# Altium schematic sheet module.SchDoc
size A4
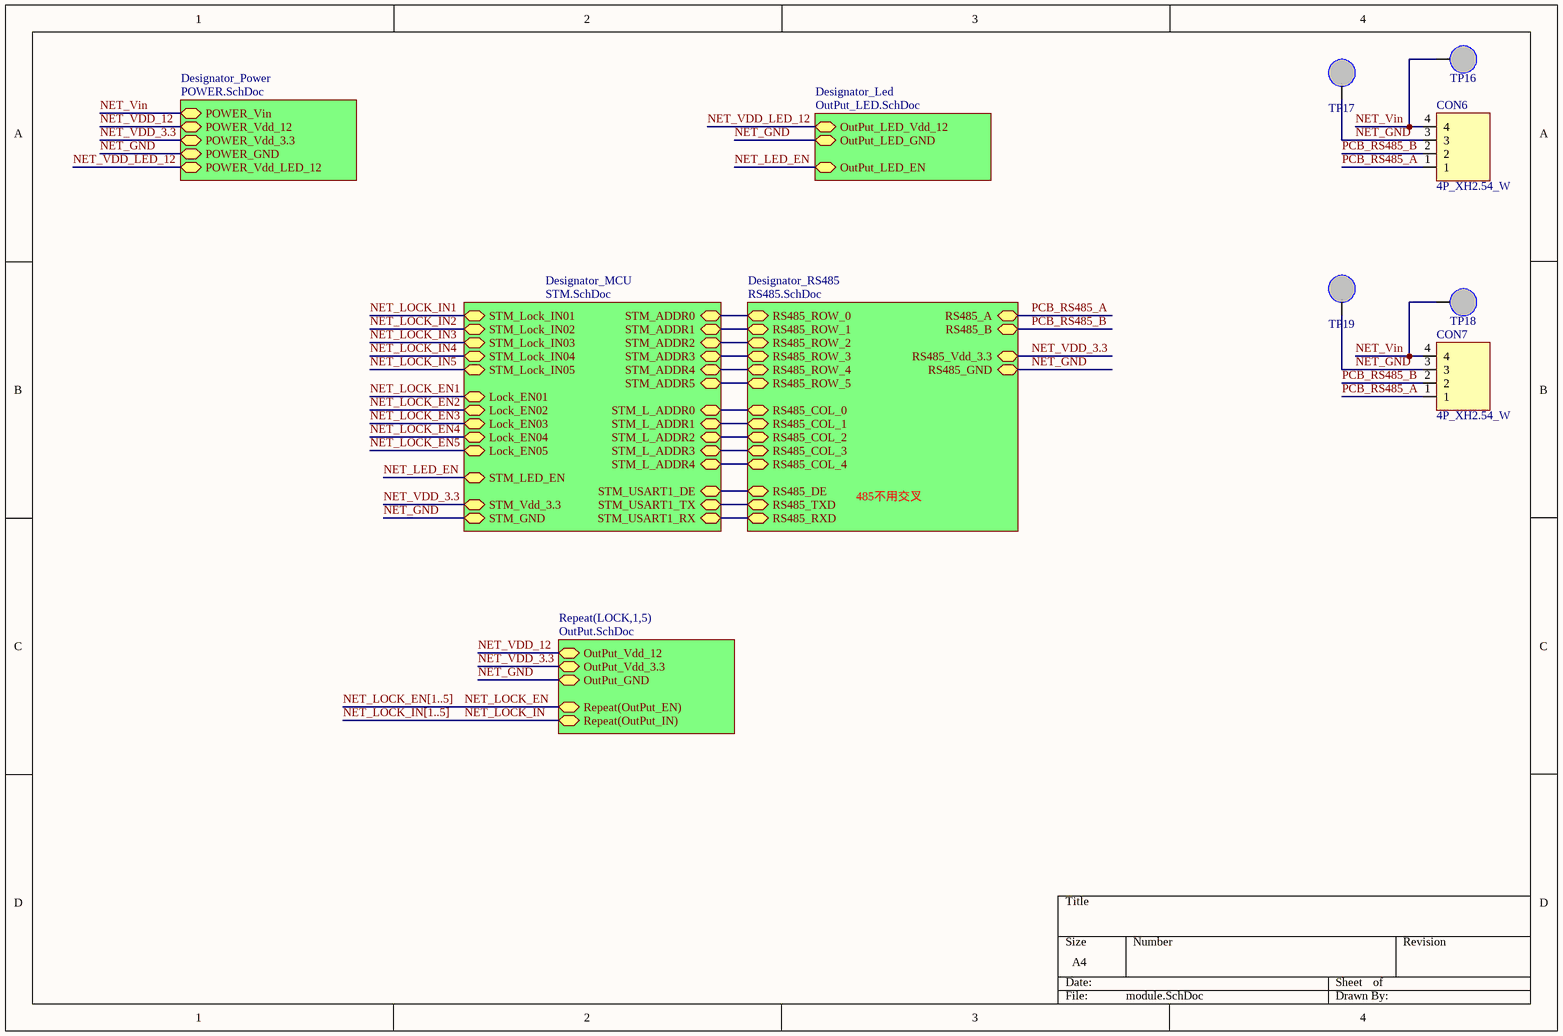
[diagram p0: module.SchDoc]

## Parts
CON6  4P_XH2.54_W  [XH2.54-WS-4P]
CON7  4P_XH2.54_W  [XH2.54-WS-4P]
TP16  TP  [TP]  (value not drawn)
TP17  TP  [TP]  (value not drawn)
TP18  TP  [TP]  (value not drawn)
TP19  TP  [TP]  (value not drawn)

## Sub-sheets
Designator_Led = OutPut_LED.SchDoc: OutPut_LED_Vdd_12, OutPut_LED_EN, OutPut_LED_GND
Designator_MCU = STM.SchDoc: STM_ADDR1, STM_ADDR5, STM_ADDR3, STM_ADDR2, STM_ADDR0, STM_ADDR4, STM_L_ADDR3, STM_L_ADDR1, STM_L_ADDR0, STM_L_ADDR2, STM_L_ADDR4, STM_USART1_RX, STM_USART1_TX, STM_USART1_DE, STM_Lock_IN05, STM_Lock_IN04, STM_Lock_IN01, STM_Lock_IN03, STM_Lock_IN02, Lock_EN05, Lock_EN04, Lock_EN03, Lock_EN02, Lock_EN01, STM_GND, STM_LED_EN, STM_Vdd_3.3
Designator_Power = POWER.SchDoc: POWER_GND, POWER_Vdd_12, POWER_Vdd_3.3, POWER_Vin, POWER_Vdd_LED_12
Designator_RS485 = RS485.SchDoc: RS485_ROW_4, RS485_ROW_2, RS485_ROW_3, RS485_ROW_0, RS485_ROW_1, RS485_COL_0, RS485_DE, RS485_RXD, RS485_GND, RS485_Vdd_3.3, RS485_TXD, RS485_COL_4, RS485_COL_3, RS485_COL_2, RS485_COL_1, RS485_ROW_5, RS485_A, RS485_B  | : 485不用交叉
Repeat(LOCK,1,5) = OutPut.SchDoc: OutPut_Vdd_3.3, Repeat(OutPut_EN), OutPut_Vdd_12, Repeat(OutPut_IN), OutPut_GND

## Nets
NET_GND: CON6.3 CON7.3 TP17.1 TP19.1 ; sheet Designator_MCU/STM_GND, sheet Designator_Power/POWER_GND, sheet Repeat(LOCK,1,5)/OutPut_GND, sheet Designator_Led/OutPut_LED_GND, sheet Designator_RS485/RS485_GND
NET_LED_EN: sheet Designator_MCU/STM_LED_EN, sheet Designator_Led/OutPut_LED_EN
NET_LOCK_EN: sheet Repeat(LOCK,1,5)/Repeat(OutPut_EN)
NET_LOCK_EN1: sheet Designator_MCU/Lock_EN01
NET_LOCK_EN2: sheet Designator_MCU/Lock_EN02
NET_LOCK_EN3: sheet Designator_MCU/Lock_EN03
NET_LOCK_EN4: sheet Designator_MCU/Lock_EN04
NET_LOCK_EN5: sheet Designator_MCU/Lock_EN05
NET_LOCK_IN: sheet Repeat(LOCK,1,5)/Repeat(OutPut_IN)
NET_LOCK_IN1: sheet Designator_MCU/STM_Lock_IN01
NET_LOCK_IN2: sheet Designator_MCU/STM_Lock_IN02
NET_LOCK_IN3: sheet Designator_MCU/STM_Lock_IN03
NET_LOCK_IN4: sheet Designator_MCU/STM_Lock_IN04
NET_LOCK_IN5: sheet Designator_MCU/STM_Lock_IN05
NET_VDD_3.3: sheet Designator_MCU/STM_Vdd_3.3, sheet Designator_Power/POWER_Vdd_3.3, sheet Repeat(LOCK,1,5)/OutPut_Vdd_3.3, sheet Designator_RS485/RS485_Vdd_3.3
NET_VDD_12: sheet Designator_Power/POWER_Vdd_12, sheet Repeat(LOCK,1,5)/OutPut_Vdd_12
NET_VDD_LED_12: sheet Designator_Power/POWER_Vdd_LED_12, sheet Designator_Led/OutPut_LED_Vdd_12
NET_Vin: CON6.4 CON7.4 TP16.1 TP18.1 ; sheet Designator_Power/POWER_Vin
PCB_RS485_A: CON6.1 CON7.1 ; sheet Designator_RS485/RS485_A
PCB_RS485_B: CON6.2 CON7.2 ; sheet Designator_RS485/RS485_B
(unnamed): sheet Designator_MCU/STM_ADDR1, sheet Designator_RS485/RS485_ROW_1
(unnamed): sheet Designator_MCU/STM_ADDR5, sheet Designator_RS485/RS485_ROW_5
(unnamed): sheet Designator_MCU/STM_ADDR3, sheet Designator_RS485/RS485_ROW_3
(unnamed): sheet Designator_MCU/STM_ADDR2, sheet Designator_RS485/RS485_ROW_2
(unnamed): sheet Designator_MCU/STM_ADDR0, sheet Designator_RS485/RS485_ROW_0
(unnamed): sheet Designator_MCU/STM_ADDR4, sheet Designator_RS485/RS485_ROW_4
(unnamed): sheet Designator_MCU/STM_L_ADDR3, sheet Designator_RS485/RS485_COL_3
(unnamed): sheet Designator_MCU/STM_L_ADDR1, sheet Designator_RS485/RS485_COL_1
(unnamed): sheet Designator_MCU/STM_L_ADDR0, sheet Designator_RS485/RS485_COL_0
(unnamed): sheet Designator_MCU/STM_L_ADDR2, sheet Designator_RS485/RS485_COL_2
(unnamed): sheet Designator_MCU/STM_L_ADDR4, sheet Designator_RS485/RS485_COL_4
(unnamed): sheet Designator_MCU/STM_USART1_RX, sheet Designator_RS485/RS485_RXD
(unnamed): sheet Designator_MCU/STM_USART1_TX, sheet Designator_RS485/RS485_TXD
(unnamed): sheet Designator_MCU/STM_USART1_DE, sheet Designator_RS485/RS485_DE

Not connected (* = marked no-connect by the designer): CON6 A B; CON7 A B

## Buses and harness runs
bus NET_LOCK_EN[1..5]
bus NET_LOCK_IN[1..5]